# Altium schematic sheet Triangular.SchDoc
size A4
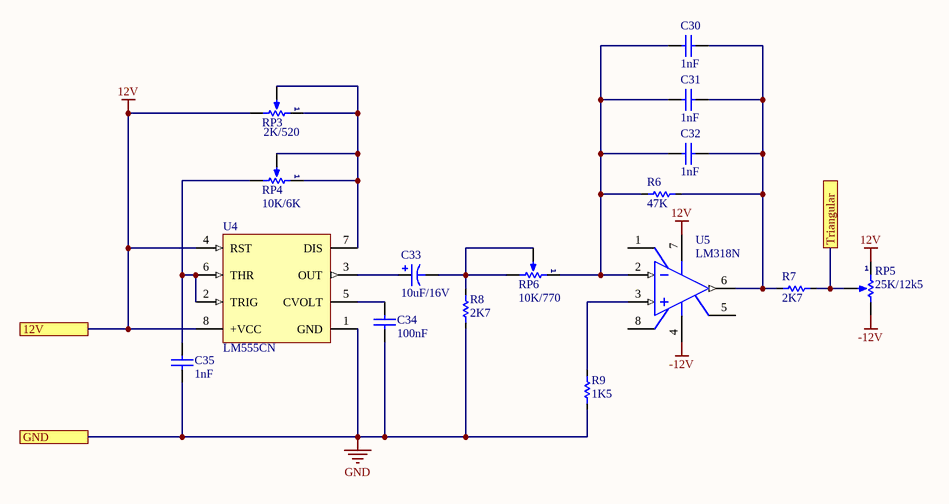
[diagram p0: Triangular.SchDoc]

## Parts
C30  VALOR: 1nF  [CAP DISCO 200mil]  (hidden comment: Cap Ceramico Disco)
C31  VALOR: 1nF  [CAP DISCO 200mil]  (hidden comment: Cap Ceramico Disco)
C32  VALOR: 1nF  [CAP DISCO 200mil]  (hidden comment: Cap Ceramico Disco)
C33  VALOR: 10uF/16V  [CAPR D250 H450 R100 mil]  (hidden comment: Cap Electrolitico Radial)
C34  VALOR: 100nF  [RAD-0.3]  (hidden comment: Cap Ceramico Disco)
C35  VALOR: 1nF  [CAP DISCO 200mil]  (hidden comment: Cap Ceramico Disco)
R6  VALOR: 47K  [1206 resistor]  (hidden comment: Res SMD)
R7  VALOR: 2K7  [1206 resistor]  (hidden comment: Res SMD)
R8  VALOR: 2K7  [1206 resistor]  (hidden comment: Res SMD)
R9  VALOR: 1K5  [1206 resistor]  (hidden comment: Res SMD)
RP3  VALOR: 2K/520  [Trimpot Multivuelta Vertical]  (hidden comment: Trimpot)
RP4  VALOR: 10K/6K  [Trimpot Multivuelta Vertical]  (hidden comment: Trimpot)
RP5  VALOR: 25K/12k5  [Trimpot Multivuelta Vertical]  (hidden comment: Trimpot)
RP6  VALOR: 10K/770  [Trimpot Multivuelta Vertical]  (hidden comment: Trimpot)
U4  LM555CN  [N08E]
U5  LM318N  [DIP-8]

## Ports
12V, GND, Triangular

## Nets
12V: RP3.2(BOT) RP5.1(TOP) U4.4(RST) U4.8(+VCC) U5.7(V+) ; port 12V
-12V: RP5.2(BOT) U5.4(V-)
GND: C34.1 C35.1 R8.1 R9.1 U4.1(GND) ; port GND
Triangular: R7.1 RP5.3(TAP) ; port Triangular
NetC30_1: C30.1 C31.1 C32.1 R6.1 R7.2 U5.6(OUT)
NetC30_2: C30.2 C31.2 C32.2 R6.2 RP6.1(TOP) U5.2(IN-)
NetC33_1: C33.1 U4.3(OUT)
NetC33_2: C33.2 R8.2 RP6.2(BOT) RP6.3(TAP)
NetC34_2: C34.2 U4.5(CVOLT)
NetC35_2: C35.2 RP4.2(BOT) U4.2(TRIG) U4.6(THR)
NetR9_2: R9.2 U5.3(IN+)
NetRP3_1: RP3.1(TOP) RP3.3(TAP) RP4.1(TOP) RP4.3(TAP) U4.7(DIS)

Not connected (* = marked no-connect by the designer): U5 1(BAL/COMP1) 5(BAL/COMP3) 8(COMP2)

## Library data of the parts
C30-C32 C34 C35 = Cap Ceramico Disco: Capacitor Ceramico de Insercion; FABRICANTE: Generico; CODIGO STI: *; PROVEEDOR: *
C33 = Cap Electrolitico Radial: Cap Electrolitico de insercion; CODIGO STI: *; PROVEEDOR: *; FABRICANTE: *
RP3-RP6 = Trimpot: Preset; CODIGO STI: *; PROVEEDOR: *; FABRICANTE: *
U4 = LM555CN: Timer, 8-pin MDIP; Manufacturer: National Semiconductor; PackageTopMarking: NSUZXYTTE#*LM*555CN; PowerWise: N; CompType: Analog IC; Published: 4-Dec-2008; DatasheetVersion: Jul-2006; PackageVersion: revG, May-2006; PackageReference: N08E; Publisher: Altium Limited; PackageDescription: MDIP, .365 x .250 x .130in, 8 Lead, .100in Pitch; Supplier 1: Farnell; Supplier Part Number 1: 9488235; PartNumber: LM555CN; RoHS: N; PinCount: 8; Code_JEDEC: MS-001-BA; ComponentLink1Description: LM555 Datasheet; ComponentLink1URL: http://www.national.com/ds/LM/LM555.pdf; ComponentLink2Description: LM555 Web Page; ComponentLink2URL: http://www.national.com/pf/LM/LM555.html; ComponentLink3Description: N08E Package Page; ComponentLink3URL: http://www.national.com/packaging/folders/n08e.html
U5 = LM318N: Operational Amplifier, 8-pin MDIP; Manufacturer: National Semiconductor; PackageTopMarking: NSUZXYTTE#*LM*318N; PowerWise: N; CompType: Amplifiers; Published: 4-Dec-2008; DatasheetVersion: Aug-2000; PackageVersion: revG, May-2006; PackageReference: N08E; Publisher: Altium Limited; PackageDescription: MDIP, .365 x .250 x .130in, 8 Lead, .100in Pitch; Supplier 1: Farnell; Supplier Part Number 1: 398550; PartNumber: LM318N; RoHS: N; PinCount: 8; Code_JEDEC: MS-001-BA; ComponentLink1Description: LM318 Datasheet; ComponentLink1URL: http://www.national.com/ds/LM/LM318.pdf; ComponentLink2Description: LM318 Web Page; ComponentLink2URL: http://www.national.com/pf/LM/LM318.html; ComponentLink3Description: N08E Package Page; ComponentLink3URL: http://www.national.com/packaging/folders/n08e.html
R6-R9 = Res SMD: CODIGO STI: *; PROVEEDOR: *; FABRICANTE: *